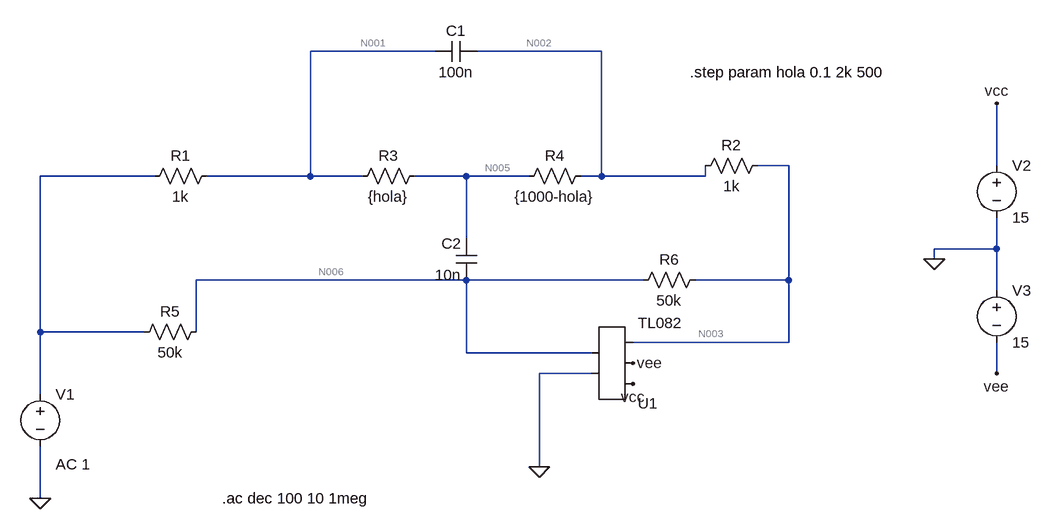
[diagram p0: schematic Spice.asc]
* Spice.asc
R1 N001 N004 1k
R2 N003 N002 1k
R3 N005 N001 {hola}
R4 N002 N005 {1000-hola}
R5 N006 N004 50k
R6 N003 N006 50k
C1 N002 N001 100n
C2 N006 N005 10n
V1 N004 0 AC 1
V2 vcc 0 15
V3 0 vee 15
* U1: TL082 (symbol AutoGenerated\TL082 not available, pins judged from their places): pin1=0 pin2=N006 pin3=vcc pin4=vee pin5=N003
.ac dec 100 10 1meg
.step param hola 0.1 2k 500
.backanno
.end

* Results of the author's LTspice run, read from the files saved beside the schematic
* Operating Point (first step), zero values left out:
*   hola = 1 m
*   V(n001) = 8.065 µV
*   V(n003) = 24.19 µV
*   V(n002) = 16.13 µV
*   V(n005) = 8.065 µV
*   V(n006) = 10.97 µV
*   V(vcc) = 15 V
*   V(vee) = -15 V
*   I(R6) = 264.5 pA
*   I(R5) = 219.4 pA
*   I(R4) = 8.065 nA
*   I(R3) = 8.065 nA
*   I(R2) = 8.065 nA
*   I(R1) = 8.065 nA
*   I(V3) = -14.19 mA
*   I(V2) = -14.19 mA
*   I(V1) = 8.284 nA
*   Ix(u1:1) = 45.05 pA
*   Ix(u1:2) = 45.05 pA
*   Ix(u1:3) = 14.19 mA
*   Ix(u1:4) = -14.19 mA
*   Ix(u1:5) = -8.329 nA
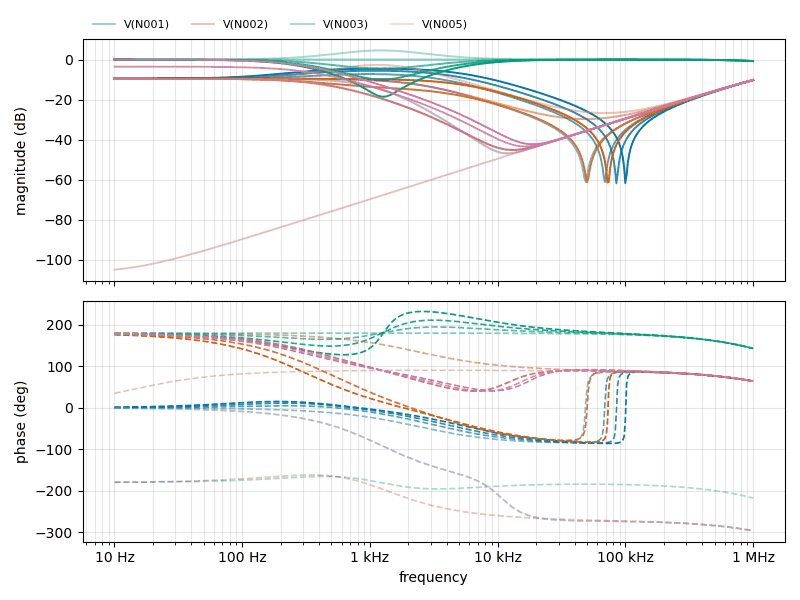
[diagram p1: AC Analysis of Spice.asc, plotted from the saved traces]
* AC Analysis, 5 runs:
*   V(N001) [hola=0.001]: -9.54 dB at 10 Hz, -10.22 dB at 1 MHz, peak -9.54 dB at 10 Hz, 3 dB below the peak at 880.3 Hz
*   V(N001) [hola=500.001]: -9.54 dB at 10 Hz, -10.24 dB at 1 MHz, peak -9.54 dB at 10 Hz, 3 dB below the peak at 2.376 kHz
*   V(N001) [hola=1000]: -9.54 dB at 10 Hz, -10.26 dB at 1 MHz, peak -7.24 dB at 977.2 Hz, 3 dB below the peak at 3.901 kHz
*   V(N001) [hola=1500]: -9.54 dB at 10 Hz, -10.27 dB at 1 MHz, peak -5.58 dB at 1.096 kHz, 3 dB below the peak at 139.9 Hz and 4.853 kHz
*   V(N001) [hola=2000]: -9.53 dB at 10 Hz, -10.29 dB at 1 MHz, peak -4.54 dB at 1.148 kHz, 3 dB below the peak at 165.3 Hz and 5.908 kHz
*   V(N002) [hola=0.001]: -9.54 dB at 10 Hz, -10.18 dB at 1 MHz, peak -2.70 dB at 1.148 kHz, 3 dB below the peak at 425.3 Hz and 2.686 kHz
*   V(N002) [hola=500.001]: -9.54 dB at 10 Hz, -10.20 dB at 1 MHz, peak -9.54 dB at 10 Hz, 3 dB below the peak at 2.399 kHz
*   V(N002) [hola=1000]: -9.54 dB at 10 Hz, -10.22 dB at 1 MHz, peak -9.54 dB at 10 Hz, 3 dB below the peak at 436 Hz
*   V(N002) [hola=1500]: -9.54 dB at 10 Hz, -10.23 dB at 1 MHz, peak -9.54 dB at 10 Hz, 3 dB below the peak at 600.1 Hz
*   V(N002) [hola=2000]: -9.54 dB at 10 Hz, -10.25 dB at 1 MHz, peak -9.54 dB at 10 Hz, 3 dB below the peak at 5.263 kHz
*   V(N003) [hola=0.001]: 0.00 dB at 10 Hz, -0.75 dB at 1 MHz, peak 4.58 dB at 1.23 kHz, 3 dB below the peak at 337.3 Hz and 4.412 kHz
*   V(N003) [hola=500.001]: -0.00 dB at 10 Hz, -0.74 dB at 1 MHz, peak 0.00 dB at 7.762 kHz
*   V(N003) [hola=1000]: -0.00 dB at 10 Hz, -0.74 dB at 1 MHz, peak -0.00 dB at 10 Hz, 3 dB below the peak at 560.9 Hz
*   V(N003) [hola=1500]: -0.00 dB at 10 Hz, -0.74 dB at 1 MHz, peak -0.00 dB at 10 Hz, 3 dB below the peak at 338.1 Hz
*   V(N003) [hola=2000]: -0.01 dB at 10 Hz, -0.73 dB at 1 MHz, peak -0.01 dB at 10 Hz, 3 dB below the peak at 272.1 Hz
*   V(N005) [hola=0.001]: -9.54 dB at 10 Hz, -10.22 dB at 1 MHz, peak -9.54 dB at 10 Hz, 3 dB below the peak at 880.3 Hz
*   V(N005) [hola=500.001]: -105.03 dB at 10 Hz, -10.22 dB at 1 MHz, peak -10.22 dB at 1 MHz, 3 dB below the peak at 677.3 kHz
*   V(N005) [hola=1000]: -9.54 dB at 10 Hz, -10.22 dB at 1 MHz, peak -9.54 dB at 10 Hz, 3 dB below the peak at 436 Hz
*   V(N005) [hola=1500]: -3.53 dB at 10 Hz, -10.21 dB at 1 MHz, peak -3.53 dB at 10 Hz, 3 dB below the peak at 351 Hz
*   V(N005) [hola=2000]: -0.01 dB at 10 Hz, -10.21 dB at 1 MHz, peak -0.01 dB at 10 Hz, 3 dB below the peak at 295.5 Hz